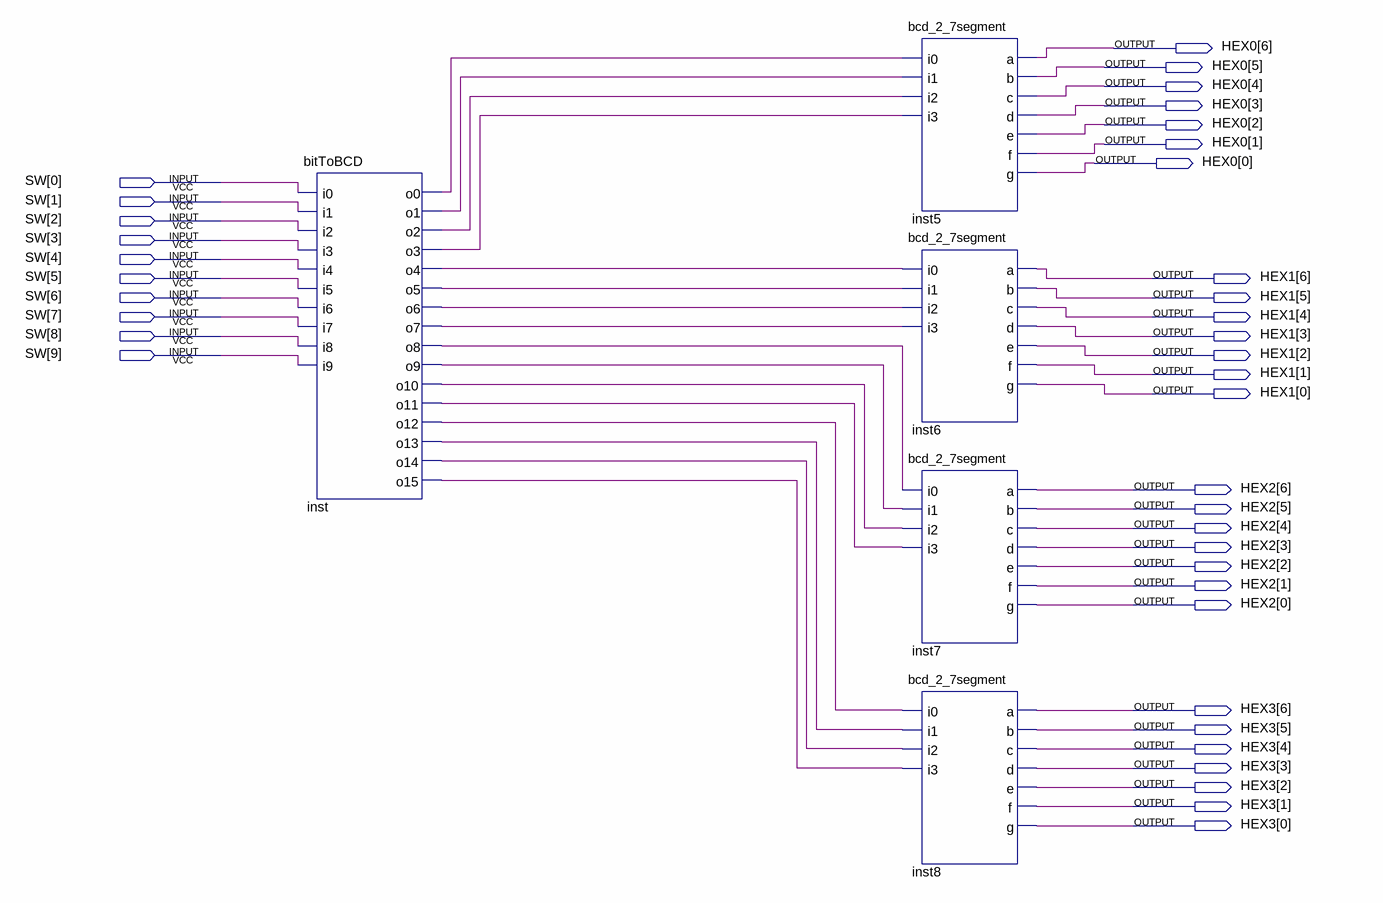
[diagram p0: schematic sheet]
// Quartus schematic binaryToBCDTeste.bdf as structural Verilog: 5 symbols, 38 pins
module binaryToBCDTeste (
  input  [9:0] SW,
  output [6:0] HEX0,
  output [6:0] HEX1,
  output [6:0] HEX2,
  output [6:0] HEX3
);

  wire inst_o0, inst_o1, inst_o2, inst_o3, inst_o4, inst_o5, inst_o6, inst_o7, inst_o8, inst_o9, inst_o10,
       inst_o11, inst_o12, inst_o13, inst_o14, inst_o15;

  bitToBCD inst (
    .i0(SW[0]), .i1(SW[1]), .i2(SW[2]), .i3(SW[3]), .i4(SW[4]), .i5(SW[5]), .i6(SW[6]), .i7(SW[7]),
    .i8(SW[8]), .i9(SW[9]), .o0(inst_o0), .o1(inst_o1), .o2(inst_o2), .o3(inst_o3), .o4(inst_o4),
    .o5(inst_o5), .o6(inst_o6), .o7(inst_o7), .o8(inst_o8), .o9(inst_o9), .o10(inst_o10), .o11(inst_o11),
    .o12(inst_o12), .o13(inst_o13), .o14(inst_o14), .o15(inst_o15));
  bcd_2_7segment inst5 (
    .i0(inst_o0), .i1(inst_o1), .i2(inst_o2), .i3(inst_o3), .a(HEX0[6]), .b(HEX0[5]), .c(HEX0[4]),
    .d(HEX0[3]), .e(HEX0[2]), .f(HEX0[1]), .g(HEX0[0]));
  bcd_2_7segment inst6 (
    .i0(inst_o4), .i1(inst_o5), .i2(inst_o6), .i3(inst_o7), .a(HEX1[6]), .b(HEX1[5]), .c(HEX1[4]),
    .d(HEX1[3]), .e(HEX1[2]), .f(HEX1[1]), .g(HEX1[0]));
  bcd_2_7segment inst7 (
    .i0(inst_o8), .i1(inst_o9), .i2(inst_o10), .i3(inst_o11), .a(HEX2[6]), .b(HEX2[5]), .c(HEX2[4]),
    .d(HEX2[3]), .e(HEX2[2]), .f(HEX2[1]), .g(HEX2[0]));
  bcd_2_7segment inst8 (
    .i0(inst_o12), .i1(inst_o13), .i2(inst_o14), .i3(inst_o15), .a(HEX3[6]), .b(HEX3[5]), .c(HEX3[4]),
    .d(HEX3[3]), .e(HEX3[2]), .f(HEX3[1]), .g(HEX3[0]));
endmodule
